# Altium schematic sheet POWER.SchDoc: OCULUS RIFT DEVELOPMENT KIT 2 (DK2) MAIN BOARD
size B; Date: 12 MAR 2014; Author: L. BAINBRIDGE; CompanyName: Oculus VR, Inc.; DrawnBy: L. BAINBRIDGE; Engineer: L. BAINBRIDGE; Organization: Oculus VR, Inc.; DocumentNumber: 5; Revision: 3.3; SheetNumber: 5; SheetTotal: 6; PageSetup: Record=PageOptions|CenterHorizontal=True|CenterVertical=True|PrintScale=1.12|XCorrection=1.00|YCorrection=1.00|PrintKind=1|BorderSize=5000000|LeftOffset=0|BottomOffset=0|Orientation=2|PaperLength=1000|PaperWidth=1000|Scale=100|PaperSource=15|PrintQuality=1200|MediaType=1|DitherType=0|PaperKind=11 x 17|PrintScaleMode=1; SheetDescription: 3.3V/1.2V SUPPLY, 3.0V LDO, LOAD SWITCHING AND AMOLED SUPPLY; PartNumber: N/A; ProjectName: DK2
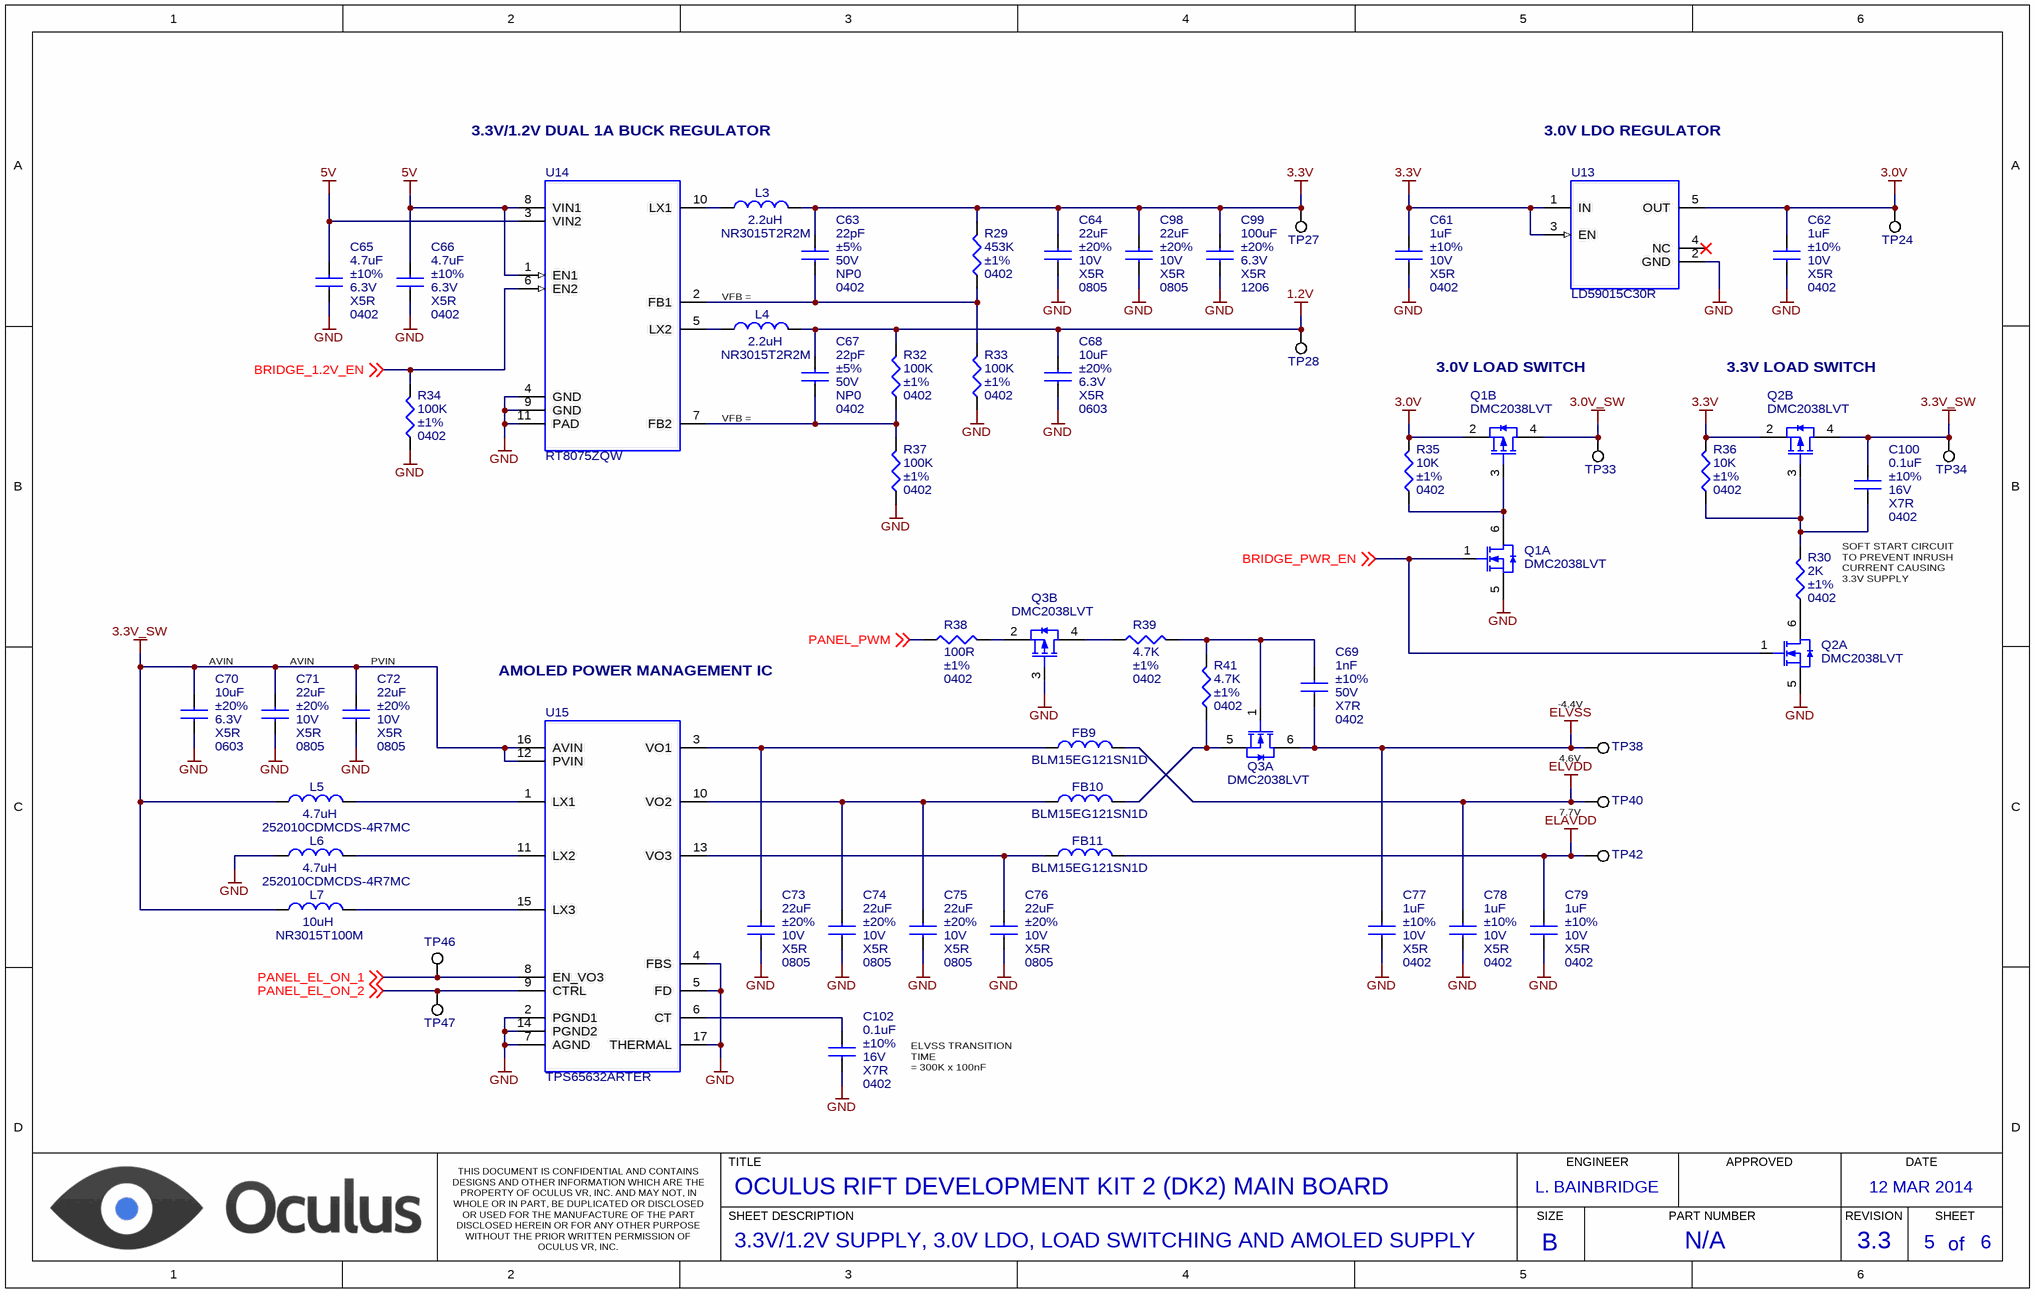
[diagram p0: POWER.SchDoc]

## Parts
C61  1uF  Tolerance: ±10%  Voltage: 10V  Dielectric: X5R  Package: 0402  [CAP_CERAMIC_0402]
C62  1uF  Tolerance: ±10%  Voltage: 10V  Dielectric: X5R  Package: 0402  [CAP_CERAMIC_0402]
C63  22pF  Tolerance: ±5%  Voltage: 50V  Dielectric: NP0  Package: 0402  [CAP_CERAMIC_0402]
C64  22uF  Tolerance: ±20%  Voltage: 10V  Dielectric: X5R  Package: 0805  [CAP_CERAMIC_0805]
C65  4.7uF  Tolerance: ±10%  Voltage: 6.3V  Dielectric: X5R  Package: 0402  [CAP_CERAMIC_0402]
C66  4.7uF  Tolerance: ±10%  Voltage: 6.3V  Dielectric: X5R  Package: 0402  [CAP_CERAMIC_0402]
C67  22pF  Tolerance: ±5%  Voltage: 50V  Dielectric: NP0  Package: 0402  [CAP_CERAMIC_0402]
C68  10uF  Tolerance: ±20%  Voltage: 6.3V  Dielectric: X5R  Package: 0603  [CAP_CERAMIC_0603]
C69  1nF  Tolerance: ±10%  Voltage: 50V  Dielectric: X7R  Package: 0402  [CAP_CERAMIC_0402]
C70  10uF  Tolerance: ±20%  Voltage: 6.3V  Dielectric: X5R  Package: 0603  [CAP_CERAMIC_0603]
C71  22uF  Tolerance: ±20%  Voltage: 10V  Dielectric: X5R  Package: 0805  [CAP_CERAMIC_0805]
C72  22uF  Tolerance: ±20%  Voltage: 10V  Dielectric: X5R  Package: 0805  [CAP_CERAMIC_0805]
C73  22uF  Tolerance: ±20%  Voltage: 10V  Dielectric: X5R  Package: 0805  [CAP_CERAMIC_0805]
C74  22uF  Tolerance: ±20%  Voltage: 10V  Dielectric: X5R  Package: 0805  [CAP_CERAMIC_0805]
C75  22uF  Tolerance: ±20%  Voltage: 10V  Dielectric: X5R  Package: 0805  [CAP_CERAMIC_0805]
C76  22uF  Tolerance: ±20%  Voltage: 10V  Dielectric: X5R  Package: 0805  [CAP_CERAMIC_0805]
C77  1uF  Tolerance: ±10%  Voltage: 10V  Dielectric: X5R  Package: 0402  [CAP_CERAMIC_0402]
C78  1uF  Tolerance: ±10%  Voltage: 10V  Dielectric: X5R  Package: 0402  [CAP_CERAMIC_0402]
C79  1uF  Tolerance: ±10%  Voltage: 10V  Dielectric: X5R  Package: 0402  [CAP_CERAMIC_0402]
C98  22uF  Tolerance: ±20%  Voltage: 10V  Dielectric: X5R  Package: 0805  [CAP_CERAMIC_0805]
C99  100uF  Tolerance: ±20%  Voltage: 6.3V  Dielectric: X5R  Package: 1206  [CAP_CERAMIC_1206]  (no BOM)
C100  0.1uF  Tolerance: ±10%  Voltage: 16V  Dielectric: X7R  Package: 0402  [CAP_CERAMIC_0402]
C102  0.1uF  Tolerance: ±10%  Voltage: 16V  Dielectric: X7R  Package: 0402  [CAP_CERAMIC_0402]
FB9  BLM15EG121SN1D  [INDUCTOR_0402]
FB10  BLM15EG121SN1D  [INDUCTOR_0402]
FB11  BLM15EG121SN1D  [INDUCTOR_0402]
L3  2.2uH  Part Number: NR3015T2R2M  [NR3015]
L4  2.2uH  Part Number: NR3015T2R2M  [NR3015]
L5  4.7uH  Part Number: 252010CDMCDS-4R7MC  [252010CDMCDS]
L6  4.7uH  Part Number: 252010CDMCDS-4R7MC  [252010CDMCDS]
L7  10uH  Part Number: NR3015T100M  [NR3015]
Q1  DMC2038LVT  [TSOT26]  (parts A,B of 2)
Q2  DMC2038LVT  [TSOT26]  (parts A,B of 2)
Q3  DMC2038LVT  [TSOT26]  (parts A,B of 2)
R29  453K  Package: 0402  Tolerance: ±1%  [RESISTOR_0402]
R30  2K  Package: 0402  Tolerance: ±1%  [RESISTOR_0402]
R32  100K  Package: 0402  Tolerance: ±1%  [RESISTOR_0402]
R33  100K  Package: 0402  Tolerance: ±1%  [RESISTOR_0402]
R34  100K  Package: 0402  Tolerance: ±1%  [RESISTOR_0402]
R35  10K  Package: 0402  Tolerance: ±1%  [RESISTOR_0402]
R36  10K  Package: 0402  Tolerance: ±1%  [RESISTOR_0402]
R37  100K  Package: 0402  Tolerance: ±1%  [RESISTOR_0402]
R38  100R  Package: 0402  Tolerance: ±1%  [RESISTOR_0402]
R39  4.7K  Package: 0402  Tolerance: ±1%  [RESISTOR_0402]
R41  4.7K  Package: 0402  Tolerance: ±1%  [RESISTOR_0402]
TP24  TEST POINT  [TEST_POINT_PAD_1.2X3MM]  (value not drawn)  (no BOM)
TP27  TEST POINT  [TEST_POINT_PAD_1MM]  (value not drawn)  (no BOM)
TP28  TEST POINT  [TEST_POINT_PAD_1MM]  (value not drawn)  (no BOM)
TP33  TEST POINT  [TEST_POINT_PAD_1MM]  (value not drawn)  (no BOM)
TP34  TEST POINT  [TEST_POINT_PAD_1MM]  (value not drawn)  (no BOM)
TP38  TEST POINT  [TEST_POINT_PAD_1MM]  (value not drawn)  (no BOM)
TP40  TEST POINT  [TEST_POINT_PAD_1MM]  (value not drawn)  (no BOM)
TP42  TEST POINT  [TEST_POINT_PAD_1MM]  (value not drawn)  (no BOM)
TP46  TEST POINT  [TEST_POINT_PAD_1MM]  (value not drawn)  (no BOM)
TP47  TEST POINT  [TEST_POINT_PAD_1MM]  (value not drawn)  (no BOM)
U13  LD59015C30R  [SOT323-5L]
U14  RT8075ZQW  [WDFN-10L]
U15  TPS65632ARTER  [S-PWQFN-N16]

## Nets
1.2V: C67.1 C68.1 L4.1 R32.2 TP28.1
3.0V: C62.1 Q1.2(S) R35.2 TP24.1 U13.5(OUT)
3.0V_SW: Q1.4(D) TP33.1
3.3V: C61.1 C63.1 C64.1 C98.1 C99.1 L3.1 Q2.2(S) R29.2 R36.2 TP27.1 U13.1(IN) U13.3(EN)
3.3V_SW: C70.1 C71.1 C72.1 C100.1 L5.2 L7.2 Q2.4(D) TP34.1 U15.12(PVIN) U15.16(AVIN)
5V: C65.1 C66.1 U14.1(EN1) U14.3(VIN2) U14.8(VIN1)
ELAVDD: C79.1 FB11.2 TP42.1
ELVDD: C78.1 FB9.2 TP40.1
ELVSS: C69.1 C77.1 Q3.6(D) TP38.1
GND: C61.2 C62.2 C64.2 C65.2 C66.2 C68.2 C70.2 C71.2 C72.2 C73.2 C74.2 C75.2 C76.2 C77.2 C78.2 C79.2 C98.2 C99.2 C102.2 L6.2 Q1.5(S) Q2.5(S) Q3.3(G) R33.1 R34.1 R37.1 U13.2(GND) U14.4(GND) U14.9(GND) U14.11(PAD) U15.2(PGND1) U15.4(FBS) U15.5(FD) U15.7(AGND) U15.14(PGND2) U15.17(THERMAL)
BRIDGE_1.2V_EN: R34.2 U14.6(EN2) ; off-sheet BRIDGE_1.2V_EN
BRIDGE_PWR_EN: Q1.1(G) Q2.1(G) ; off-sheet BRIDGE_PWR_EN
PANEL_EL_ON_1: TP46.1 U15.8(EN_VO3) ; off-sheet PANEL_EL_ON_1
PANEL_EL_ON_2: TP47.1 U15.9(CTRL) ; off-sheet PANEL_EL_ON_2
PANEL_PWM: R38.1 ; off-sheet PANEL_PWM
NetC63_2: C63.2 R29.1 R33.2 U14.2(FB1)
NetC67_2: C67.2 R32.1 R37.2 U14.7(FB2)
NetC69_2: C69.2 Q3.1(G) R39.2 R41.2
NetC73_1: C73.1 FB9.1 U15.3(VO1)
NetC74_1: C74.1 C75.1 FB10.1 U15.10(VO2)
NetC76_1: C76.1 FB11.1 U15.13(VO3)
NetC100_2: C100.2 Q2.3(G) R30.2 R36.1
NetC102_1: C102.1 U15.6(CT)
NetFB10_2: FB10.2 Q3.5(S) R41.1
NetL3_2: L3.2 U14.10(LX1)
NetL4_2: L4.2 U14.5(LX2)
NetL5_1: L5.1 U15.1(LX1)
NetL6_1: L6.1 U15.11(LX2)
NetL7_1: L7.1 U15.15(LX3)
NetQ1_3: Q1.3(G) Q1.6(D) R35.1
NetQ2_6: Q2.6(D) R30.1
NetQ3_2: Q3.2(S) R38.2
NetQ3_4: Q3.4(D) R39.1

Not connected (* = marked no-connect by the designer): U13 4(NC)*

## Notes on the sheet
- 3.3V/1.2V DUAL 1A BUCK REGULATOR
- 3.0V LDO REGULATOR
- VFB = 0.6V
- 3.0V LOAD SWITCH
- 3.3V LOAD SWITCH
- SOFT START CIRCUIT TO PREVENT INRUSH CURRENT CAUSING 3.3V SUPPLY VOLTAGE DROP
- AVIN
- (near C72) PVIN
- AMOLED POWER MANAGEMENT IC
- (near TP38) -4.4V
- (near TP38) 4.6V
- (near TP40) 7.7V
- ELVSS TRANSITION TIME
  = 300K x 100nF
  = 30ms
- TITLE
- ENGINEER
- APPROVED
- DATE
- THIS DOCUMENT IS CONFIDENTIAL AND CONTAINS DESIGNS AND OTHER INFORMATION WHICH ARE THE PROPERTY OF OCULUS VR, INC. AND MAY NOT, IN WHOLE OR IN PART, BE DUPLICATED OR DISCLOSED OR USED FOR THE MANUFACTURE OF THE PART DISCLOSED HEREIN OR FOR ANY OTHER PURPOSE WITHOUT THE PRIOR WRITTEN PERMISSION OF OCULUS VR, INC.
- SHEET DESCRIPTION
- SIZE
- PART NUMBER
- REVISION
- SHEET
- of
- B

## Library data of the parts
C61 C62 C77-C79 = CAP, CERAMIC: CAP, CERAMIC, 1uF, ±10%, 10V, X5R, 0402; Manufacturer: MURATA ELECTRONICS; Part Number: GRM155R61A105KE15D
C63 C67 = CAP, CERAMIC: CAP, CERAMIC, 22pF, ±5%, 50V, NP0, 0402; Manufacturer: MURATA ELECTRONICS; Part Number: GRM1535C1H220JDD5D
C64 C71-C76 C98 = CAP, CERAMIC: CAP, CERAMIC, 22uF, ±20%, 10V, X5R, 0805; Manufacturer: SAMSUNG; Part Number: CL21A226MPQNNNE
C65 C66 = CAP, CERAMIC: CAP, CERAMIC, 4.7uF, ±10%, 6.3V, X5R, 0402; Manufacturer: TDK CORPORATION; Part Number: C1005X5R0J475K
C68 C70 = CAP, CERAMIC: CAP, CERAMIC, 10uF, ±20%, 6.3V, X5R, 0603; Manufacturer: MURATA ELECTRONICS; Part Number: GRM188R60J106ME47D
C69 = CAP, CERAMIC: CAP, CERAMIC, 1nF, ±10%, 50V, X7R, 0402; Manufacturer: MURATA ELECTRONICS; Part Number: GRM155R71H102KA01D
C99 = CAP, CERAMIC: CAP, CERAMIC, 100uF, ±20%, 6.3V, X5R, 1206; Manufacturer: MURATA ELECTRONICS; Part Number: GRM31CR60J107ME39K; DNP: DNP
C100 C102 = CAP, CERAMIC: CAP, CERAMIC, 0.1uF, ±10%, 16V, X7R, 0402; Manufacturer: MURATA ELECTRONICS; Part Number: GRM155R71C104KA88D
FB9-FB11 = INDUCTOR: FERRITE CHIP BEAD, 120 OHM @ 100MHz, 1.5A, 0402; Manufacturer: MURATA ELECTRONICS; Impedance: 22 ohm @ 100MHz; Part Number: BLM15EG121SN1D; Package: 0402
L3 L4 = INDUCTOR: INDUCTOR, SHIELDED POWER, 2.2uH, 1.5A; Manufacturer: TAIYO YUDEN
L5 L6 = INDUCTOR: INDUCTOR, SHIELDED POWER, 4.7uH, 1.4A; Manufacturer: SUMIDA
L7 = INDUCTOR: INDUCTOR, SHIELDED POWER, 10uH, 730mA; Manufacturer: TAIYO YUDEN
Q1-Q3 = DMC2038LVT: FET, COMPLEMENTARY, LOGIC LEVEL; Manufacturer: DIODES INC; Part Number: DMC2038LVT
R29 = RESISTOR: RES, 453K OHM, 1/10W, ±1%, 0402; Manufacturer: PANASONIC; Part Number: ERJ-2RKF4533X; Power Rating: 1/10W
R30 = RESISTOR: RES, 2K OHM, 1/10W, ±1%, 0402; Manufacturer: PANASONIC; Part Number: ERJ-2RKF2001X; Power Rating: 1/10W
R32-R34 R37 = RESISTOR: RES, 100K OHM, 1/10W, ±1%, 0402; Manufacturer: PANASONIC; Part Number: ERJ-2RKF1003X; Power Rating: 1/10W
R35 R36 = RESISTOR: RES, 10K OHM, 1/10W, ±1%, 0402; Manufacturer: PANASONIC; Part Number: ERJ-2RKF1002X; Power Rating: 1/10W
R38 = RESISTOR: RES, 100 OHM, 1/10W, ±1%, 0402; Manufacturer: PANASONIC; Part Number: ERJ-2RKF1000X; Power Rating: 1/10W
R39 R41 = RESISTOR: RES, 4.7K OHM, 1/10W, ±1%, 0402; Manufacturer: PANASONIC; Part Number: ERJ-2RKF4701X; Power Rating: 1/10W
TP24 TP27 TP28 TP33 TP34 TP38 TP40 TP42 TP46 TP47 = TEST_POINT_GENERIC: Manufacturer: *; Part Number: *
U13 = LD59015C30R: IC, LDO REGULATOR, 3.0V, 150mA, HIGH PSRR; Manufacturer: STMICROELECTRONICS; Part Number: LD59015C30R; Pinout verified: *
U14 = RT8075ZQW: IC, DUAL STEP DOWN CONVERTER, 1A, 1.25MHz; Manufacturer: RICHTEK; Part Number: RT8075ZQW; Pinout verified: *
U15 = TPS65632ARTER: IC, TRIPLE OUTPUT AMOLED DISPLAY POWER SUPPLY; Manufacturer: TEXAS INSTRUMENTS; Part Number: TPS65632ARTER